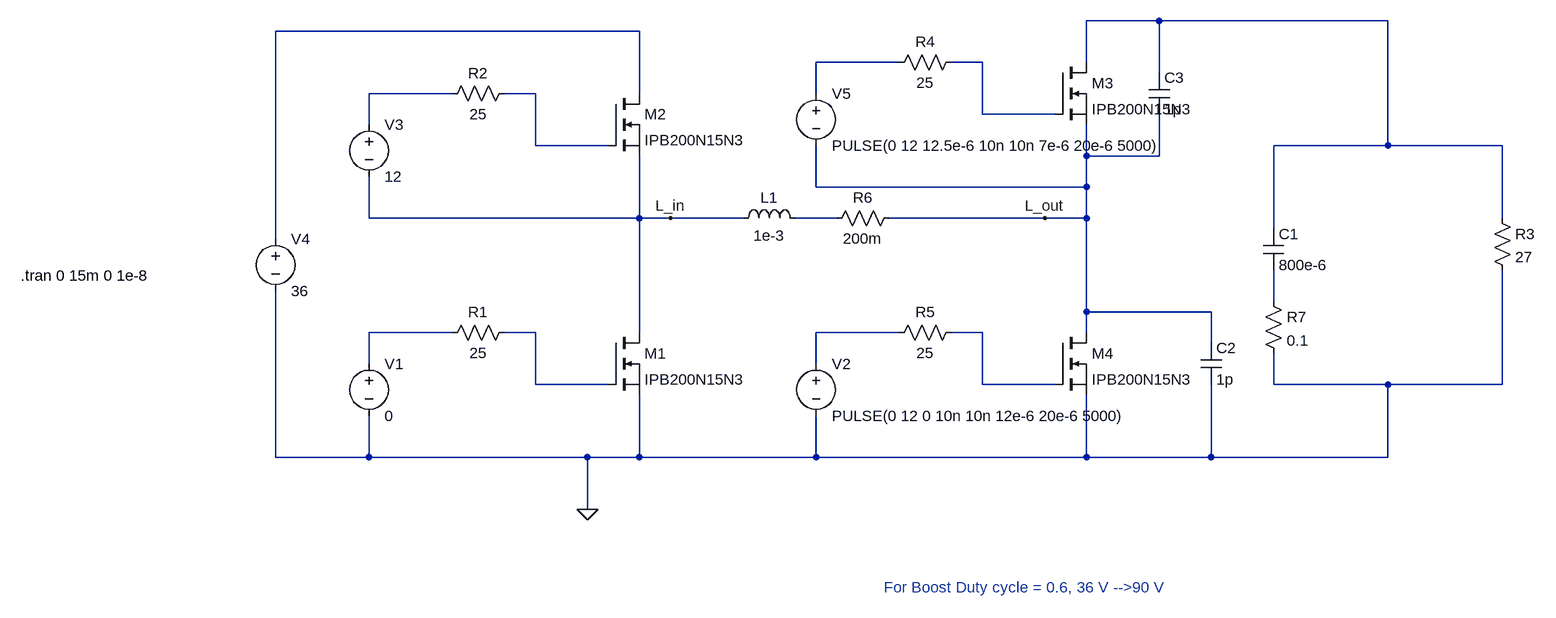
[diagram p0: schematic MOSFET_boost_Temp.asc]
MOSFET_boost_Temp.asc, the LTspice schematic file:
Version 4
SHEET 1 1832 680
WIRE 1248 -400 1136 -400
WIRE 1600 -400 1248 -400
WIRE 448 -384 -112 -384
WIRE 848 -336 720 -336
WIRE 976 -336 928 -336
WIRE 1136 -336 1136 -400
WIRE 1248 -320 1248 -400
WIRE 160 -288 32 -288
WIRE 288 -288 240 -288
WIRE 448 -288 448 -384
WIRE 720 -288 720 -336
WIRE 976 -256 976 -336
WIRE 1088 -256 976 -256
WIRE 32 -240 32 -288
WIRE 288 -208 288 -288
WIRE 400 -208 288 -208
WIRE 1600 -208 1600 -400
WIRE 1600 -208 1424 -208
WIRE 1776 -208 1600 -208
WIRE 1136 -192 1136 -240
WIRE 1248 -192 1248 -256
WIRE 1248 -192 1136 -192
WIRE 720 -144 720 -208
WIRE 1136 -144 1136 -192
WIRE 1136 -144 720 -144
WIRE 32 -96 32 -160
WIRE 448 -96 448 -192
WIRE 448 -96 32 -96
WIRE 496 -96 448 -96
WIRE 608 -96 496 -96
WIRE 752 -96 688 -96
WIRE 1072 -96 832 -96
WIRE 1136 -96 1136 -144
WIRE 1136 -96 1072 -96
WIRE 1776 -96 1776 -208
WIRE 1424 -80 1424 -208
WIRE -112 -64 -112 -384
WIRE 1424 32 1424 -16
WIRE 1136 48 1136 -96
WIRE 1328 48 1136 48
WIRE 160 80 32 80
WIRE 288 80 240 80
WIRE 448 80 448 -96
WIRE 848 80 720 80
WIRE 976 80 928 80
WIRE 1136 80 1136 48
WIRE 1328 96 1328 48
WIRE 32 128 32 80
WIRE 720 128 720 80
WIRE 288 160 288 80
WIRE 400 160 288 160
WIRE 976 160 976 80
WIRE 1088 160 976 160
WIRE 1424 160 1424 112
WIRE 1600 160 1424 160
WIRE 1776 160 1776 -16
WIRE 1776 160 1600 160
WIRE -112 272 -112 16
WIRE 32 272 32 208
WIRE 32 272 -112 272
WIRE 368 272 32 272
WIRE 448 272 448 176
WIRE 448 272 368 272
WIRE 720 272 720 208
WIRE 720 272 448 272
WIRE 1136 272 1136 176
WIRE 1136 272 720 272
WIRE 1328 272 1328 160
WIRE 1328 272 1136 272
WIRE 1600 272 1600 160
WIRE 1600 272 1328 272
WIRE 368 352 368 272
FLAG 368 352 0
FLAG 1072 -96 L_out
FLAG 496 -96 L_in
SYMBOL voltage 32 112 R0
WINDOW 123 0 0 Left 0
WINDOW 39 0 0 Left 0
SYMATTR InstName V1
SYMATTR Value 0
SYMBOL nmos 400 80 R0
SYMATTR InstName M1
SYMATTR Value IPB200N15N3
SYMBOL res 256 64 R90
WINDOW 0 0 56 VBottom 2
WINDOW 3 32 56 VTop 2
SYMATTR InstName R1
SYMATTR Value 25
SYMBOL voltage 32 -256 R0
WINDOW 123 0 0 Left 0
WINDOW 39 0 0 Left 0
SYMATTR InstName V3
SYMATTR Value 12
SYMBOL nmos 400 -288 R0
SYMATTR InstName M2
SYMATTR Value IPB200N15N3
SYMBOL res 256 -304 R90
WINDOW 0 0 56 VBottom 2
WINDOW 3 32 56 VTop 2
SYMATTR InstName R2
SYMATTR Value 25
SYMBOL voltage -112 -80 R0
WINDOW 123 0 0 Left 0
WINDOW 39 0 0 Left 0
SYMATTR InstName V4
SYMATTR Value 36
SYMBOL cap 1408 -80 R0
SYMATTR InstName C1
SYMATTR Value 800e-6
SYMBOL ind 592 -80 R270
WINDOW 0 32 56 VTop 2
WINDOW 3 5 56 VBottom 2
SYMATTR InstName L1
SYMATTR Value 1e-3
SYMBOL res 1760 -112 R0
SYMATTR InstName R3
SYMATTR Value 27
SYMBOL nmos 1088 -336 R0
SYMATTR InstName M3
SYMATTR Value IPB200N15N3
SYMBOL res 944 -352 R90
WINDOW 0 0 56 VBottom 2
WINDOW 3 32 56 VTop 2
SYMATTR InstName R4
SYMATTR Value 25
SYMBOL nmos 1088 80 R0
SYMATTR InstName M4
SYMATTR Value IPB200N15N3
SYMBOL res 944 64 R90
WINDOW 0 0 56 VBottom 2
WINDOW 3 32 56 VTop 2
SYMATTR InstName R5
SYMATTR Value 25
SYMBOL res 848 -112 R90
WINDOW 0 0 56 VBottom 2
WINDOW 3 32 56 VTop 2
SYMATTR InstName R6
SYMATTR Value 200m
SYMBOL res 1408 16 R0
SYMATTR InstName R7
SYMATTR Value 0.1
SYMBOL voltage 720 112 R0
WINDOW 123 0 0 Left 0
WINDOW 39 0 0 Left 0
SYMATTR InstName V2
SYMATTR Value PULSE(0 12 0 10n 10n 12e-6 20e-6 5000)
SYMBOL voltage 720 -304 R0
WINDOW 123 0 0 Left 0
WINDOW 39 0 0 Left 0
SYMATTR InstName V5
SYMATTR Value PULSE(0 12 12.5e-6 10n 10n 7e-6 20e-6 5000)
SYMBOL cap 1312 96 R0
SYMATTR InstName C2
SYMATTR Value 1p
SYMBOL cap 1232 -320 R0
SYMATTR InstName C3
SYMATTR Value 1p
TEXT -504 -8 Left 2 !.tran 0 15m 0 1e-8
TEXT 824 472 Left 2 ;For Boost Duty cycle = 0.6, 36 V -->90 V

The netlist it stands for:
* MOSFET_boost_Temp.asc
V1 N009 0 0
M1 L_in N010 0 0 IPB200N15N3
R1 N010 N009 25
V3 N005 L_in 12
M2 N002 N006 L_in L_in IPB200N15N3
R2 N006 N005 25
V4 N002 0 36
C1 N001 N008 800e-6
L1 L_in N007 1e-3
R3 N001 0 27
M3 N001 N004 L_out L_out IPB200N15N3
R4 N004 N003 25
M4 L_out N012 0 0 IPB200N15N3
R5 N012 N011 25
R6 L_out N007 200m
R7 N008 0 0.1
V2 N011 0 PULSE(0 12 0 10n 10n 12e-6 20e-6 5000)
V5 N003 L_out PULSE(0 12 12.5e-6 10n 10n 7e-6 20e-6 5000)
C2 L_out 0 1p
C3 N001 L_out 1p
.model NMOS NMOS
.model PMOS PMOS
.lib standard.mos
.tran 0 15m 0 1e-8
* For Boost Duty cycle = 0.6, 36 V -->90 V
.backanno
.end